# EAGLE design LTC3115 - przetwornica ogniwo (EAGLE 6.3)
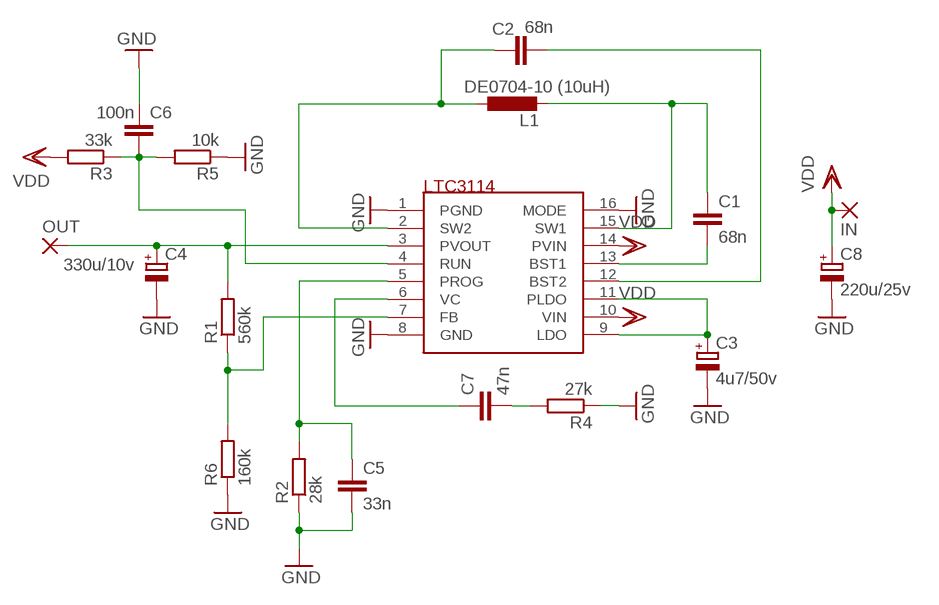
[diagram p0: schematic, sheet 1]

## Parts
C1  68n  C-EUC0805  [C0805]
C2  68n  C-EUC0805  [C0805]
C3  4u7/50v  CPOL-EUE2,5-6E  [E2,5-6E]
C4  330u/10v  CPOL-EUE2,5-6E  [E2,5-6E]
C5  33n  C-EUC0805  [C0805]
C6  100n  C-EUC0805  [C0805]
C7  47n  C-EUC0805  [C0805]
C8  220u/25v  CPOL-EUE2,5-6E  [E2,5-6E]
IN  1,6/0,8  [1,6/0,8]
L1  DE0704-10 (10uH)  L-EUL3225M  [L3225M]
OUT  1,6/0,8  [1,6/0,8]
R1  560k  R-EU_M0805  [M0805]
R2  28k  R-EU_M0805  [M0805]
R3  33k  R-EU_M0805  [M0805]
R4  27k  R-EU_M0805  [M0805]
R5  10k  R-EU_M0805  [M0805]
R6  160k  R-EU_M0805  [M0805]
U$1  LTC3114  [TSSOP16]

## Nets
GND: C3.- C4.- C5.2 C6.1 C8.- R2.1 R4.1 R5.1 R6.1 U$1.1(PGND) U$1.8(GND) U$1.16(MODE)
N$1: C1.2 U$1.13(BST1)
N$2: C1.1 L1.2 U$1.15(SW1)
N$3: C2.1 U$1.12(BST2)
N$4: C2.2 L1.1 U$1.2(SW2)
N$5: C3.+ U$1.9(LDO) U$1.11(PLDO)
N$6: R1.1 R6.2 U$1.7(FB)
N$7: C4.+ OUT.1(P) R1.2 U$1.3(PVOUT)
N$8: C6.2 R3.1 R5.2 U$1.4(RUN)
N$9: C5.1 R2.2 U$1.5(PROG)
N$13: C7.2 R4.2
N$14: C7.1 U$1.6(VC)
VDD: C8.+ IN.1(P) R3.2 U$1.10(VIN) U$1.14(PVIN)

## Library data of the parts
C1 C2 = resistor:C-EU: CAPACITOR, European symbol
C3 C4 C8 = rcl:CPOL-EU: POLARIZED CAPACITOR, European symbol
C5-C7 = rcl:C-EU: CAPACITOR, European symbol
IN OUT = wirepad:1,6/0,8: THROUGH-HOLE PAD
L1 = rcl:L-EU: INDUCTOR, European symbol
R1-R6 = rcl:R-EU_: RESISTOR, European symbol
U$1 = ref-packages:LTC3114

## Net classes
0 default: clearance 0.7 mm

## Board
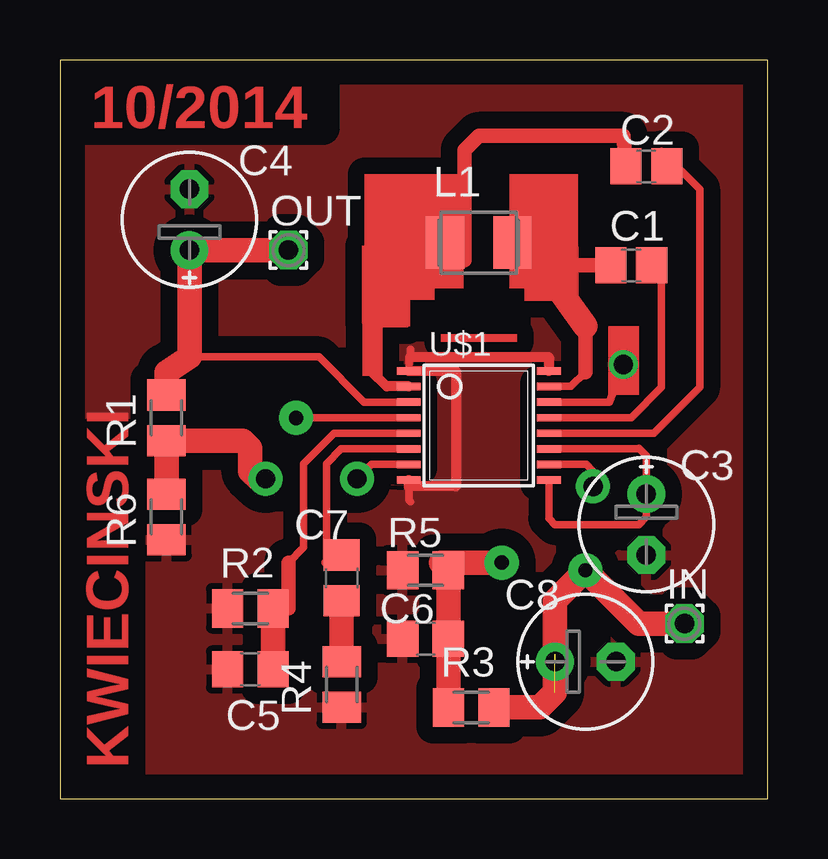
[diagram p1: board, top side]
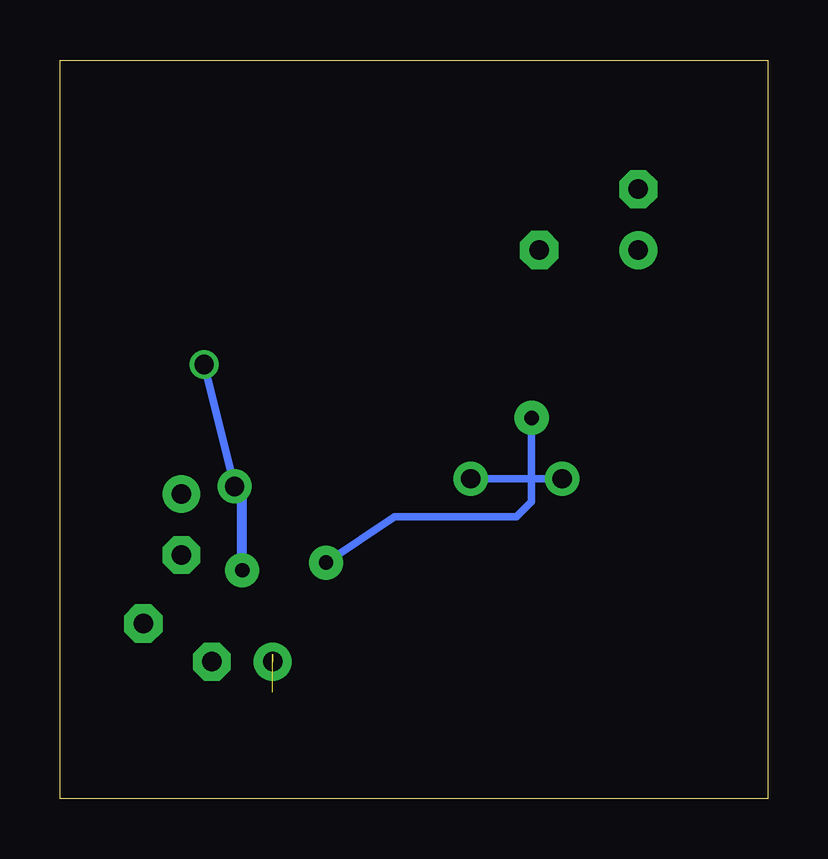
[diagram p2: board, bottom side, seen from below]

Size 29.51 x 30.79 mm. Coordinates in mm from the lower left corner, seen from the top.
Outline: 0,0 29.51,0 29.51,30.79 0,30.79 0,0
Copper layers (1*16): Top 0.035mm / dielectric 1.5mm / Bottom 0.035mm
Design rules "default": minimum track width 10mil, minimum drill 24mil, track to track 8mil, track to pad 8mil, pad to pad 8mil, via to via 8mil, smd to smd 8mil, copper to edge 40mil, drill to drill 8mil, minimum pad ring 10mil, minimum via ring 8mil, stop-mask expansion 4mil, vias tented up to drill 0mil, thermal gap 10mil

### Footprints (pad centres in the part's own frame; a part is rotated, then mirrored left to right if it is on the bottom)
C0805 = smd 1.3 x 1.5: 1 -0.85,0; 2 0.85,0
E2,5-6E = drill 0.813 pad 1.575: + -1.27,0 | drill 0.813 pad 1.575 octagon: - 1.27,0
C0805' = smd 1.3 x 1.5: 1 -0.95,0; 2 0.95,0
1,6/0,8 = drill 0.813 pad 1.6 octagon: 1 0,0
L3225M = smd 1.6 x 2.2: 1 -1.4,0; 2 1.4,0
M0805 = smd 1.3 x 1.6: 1 -0.95,0; 2 0.95,0
TSSOP16 = smd 0.305 x 0.991: 1 -2.275,-2.918; 2 -1.625,-2.918; 3 -0.975,-2.918; 4 -0.325,-2.918; 5 0.325,-2.918; 6 0.975,-2.918; 7 1.625,-2.918; 8 2.275,-2.918; 9 2.275,2.918; 10 1.625,2.918; 11 0.975,2.918; 12 0.325,2.918; 13 -0.325,2.918; 14 -0.975,2.918; 15 -1.625,2.918; 16 -2.275,2.918

### Placement (x,y rotation side)
C1  23.81,22.22 0 top
C2  24.45,26.35 180 top
C3  24.45,11.43 270 top
C4  5.4,24.13 90 top
C5  33n  [C0805']  7.94,5.4 180 top
C6  100n  [C0805']  15.24,6.67 0 top
C7  47n  [C0805']  11.75,9.21 270 top
C8  21.91,5.71 0 top
IN  26.04,7.3 0 top
L1  17.46,23.18 0 top
OUT  9.53,22.86 0 top
R1  4.44,15.88 90 top
R2  7.94,7.94 0 top
R3  17.15,3.81 0 top
R4  11.75,4.76 90 top
R5  15.24,9.52 0 top
R6  4.44,11.75 90 top
U$1  17.46,15.56 270 top

### Tracks (layer width: path | path; a pad name or v marks a point on that pad's centre or on a via)
GND
  Top 0.305: U$1.1 14.54,18.35 14.6,18.42 14.6,18.73 | U$1.8 14.54,12.44 14.6,12.38
  Top 0.406: 14.6,18.42 20.38,18.42 U$1.16 | U$1.1 16.51,17.83 16.51,13.02 14.54,13.02 U$1.8
  pour Top: -5.4,-9.84 41.59,-9.84 41.59,34.61 -5.4,34.61
N$1
  Top 0.305: U$1.13 23.82,15.88 25.08,17.14 25.08,21.81 C1.2
N$2
  Top 0.305: U$1.15 21.31,17.18 21.91,17.78 | 20.32,21.91 20,21.91 | 20,21.91 L1.2 | 20.32,22.22 20,21.91
  Top 0.61: 21.91,17.78 21.91,19.68 | C1.1 20.32,22.22
  Top 1.016: 21.91,19.68 20.32,21.91
N$3
  Top 0.305: C2.1 25.08,26.99 26.67,25.4 26.67,17.14 24.76,15.24 U$1.12
N$4
  Top 0.305: 13.02,17.78 13.02,19.68 15.24,21.91 L1.1 16.86,22.44
  Top 0.406: U$1.2 13.62,17.18 13.02,17.78
  Top 0.61: C2.2 23.5,27.62 17.46,27.62 16.86,27.02 16.86,22.44
N$5
  Top 0.305: 24.15,14.58 U$1.11 24.11,14.58 24.13,14.61 24.15,14.58 | 24.15,14.58 24.45,14.29 C3.+ 24.45,11.75 24.13,11.43 20.64,11.43 20.38,11.69 U$1.9
N$6  (via drill 0.8 pad 1.42)
  Top 0.305: U$1.7 12.98,13.93 v12.38,13.34
  Top 0.61: 7.62,14.93 7.62,14.92
  Top 1.016: v8.57,13.34 8.26,13.34 7.94,13.65 7.94,14.61 7.62,14.92 | R6.2 R1.1 7.62,14.93
  Bottom 0.305: v12.38,13.34 v8.57,13.34
N$7
  Top 0.305: U$1.3 12.68,16.53 10.79,18.42 5.4,18.42
  Top 1.016: OUT.1 C4.+ 5.4,18.42 4.44,17.78 R1.2
N$8  (via drill 0.6 pad 1.42)
  Top 0.305: U$1.4 v9.85,15.88 v9.84,15.87 | 15.87,9.84 R5.2
  Top 0.406: R3.1
  Top 1.016: R3.1 C6.2 R5.2 | v18.42,9.84 15.87,9.84
  Bottom 0.305: v9.84,15.87 9.84,12.38 10.48,11.75 15.56,11.75 v18.42,9.84
N$9
  Top 0.305: U$1.5 11.42,15.23 10.16,13.97 10.16,10.48 9.53,9.84
  Top 0.61: 9.53,9.84 9.53,7.94 R2.2 | C5.1
  Top 1.016: C5.1 R2.2
N$13
  Top 1.016: C7.2 R4.2
N$14
  Top 0.305: U$1.6 11.72,14.58 11.11,13.97 11.11,9.84
  Top 0.406: C7.1 11.43,10.16 11.11,9.84
VDD  (via drill 0.6 pad 1.42, 0.8 pad 1.2, 0.8 pad 1.42)  (2 unrouted)
  Top 0.305: U$1.10 21.94,13.93 22.22,13.65 v22.22,13.02 | v23.5,18.1 22.9,16.53 20.44,16.53 U$1.14
  Top 0.406: R3.2 18.42,3.81
  Top 1.016: 18.42,3.81 20,3.81 20.64,4.45 20.64,8.25 v21.91,9.52 24.13,7.3 IN.1
  Bottom 0.305: v22.22,13.02 v23.5,18.1
  Bottom 0.406: v21.91,9.52 21.91,12.7 v22.22,13.02
(copper drawn outside any net)
  shapes: Top area x13

### Text on the board
Top: 10/2014 | KWIECINSKI